# Altium schematic sheet M_Board1_2011.SchDoc
size A4
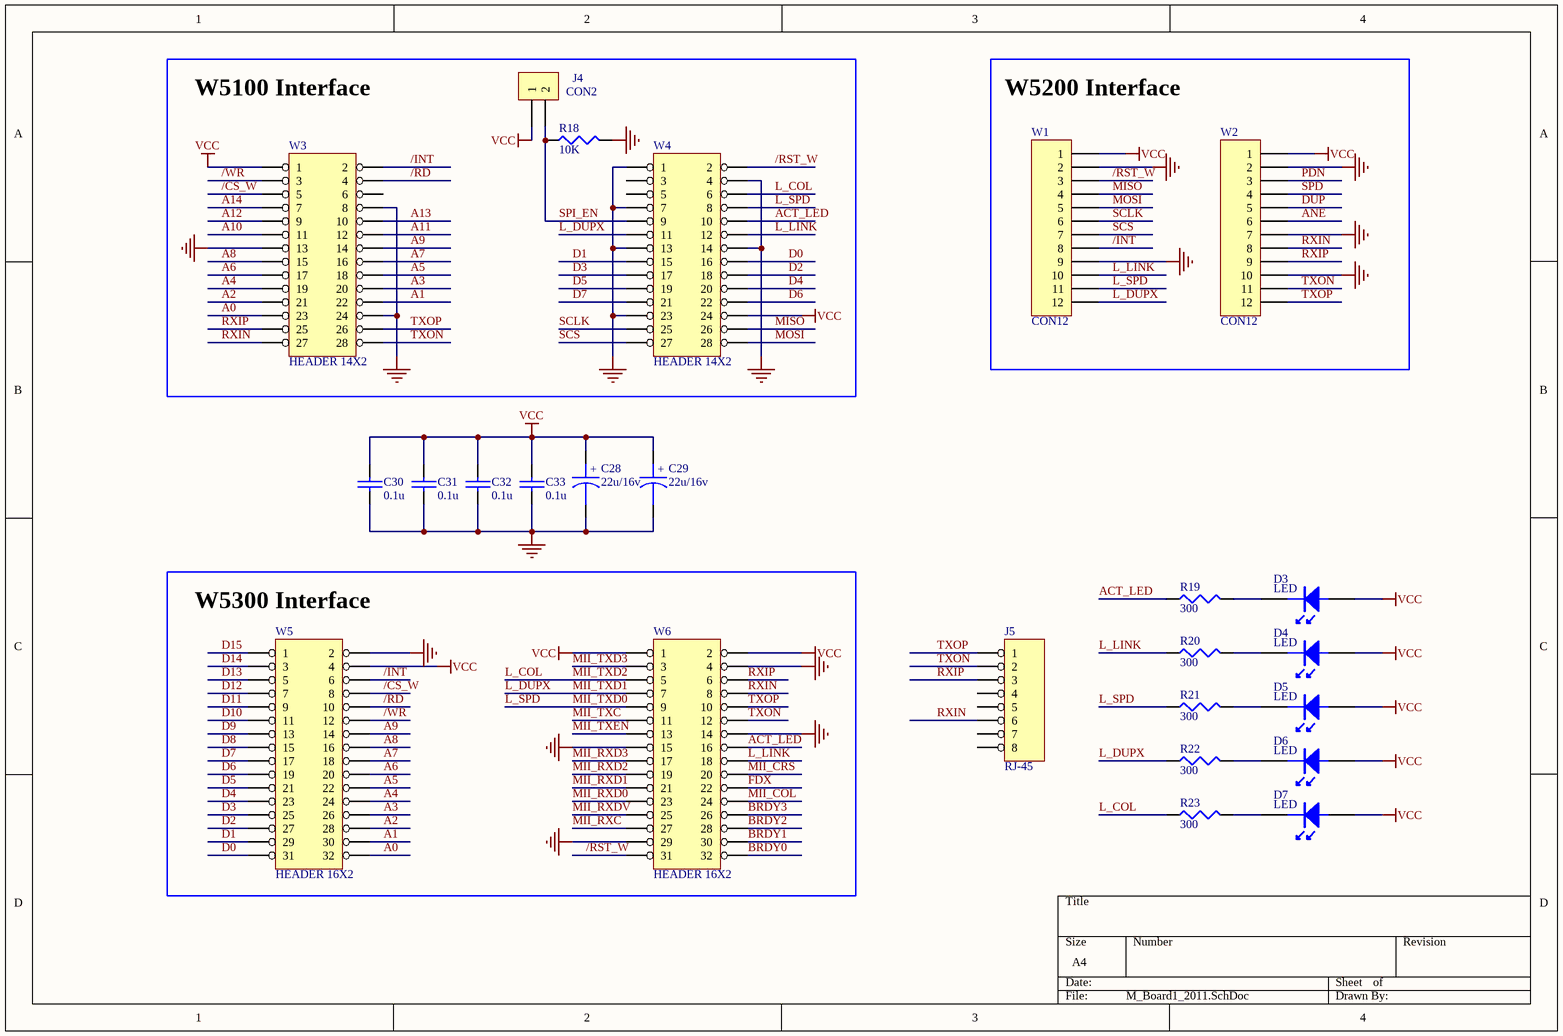
[diagram p0: M_Board1_2011.SchDoc]

## Parts
C28  22u/16v  [RB.1/.2N]
C29  22u/16v  [RB.1/.2N]
C30  0.1u  [0603]
C31  0.1u  [0603]
C32  0.1u  [0603]
C33  0.1u  [0603]
D3  LED  [LED2P]
D4  LED  [LED2P]
D5  LED  [LED2P]
D6  LED  [LED2P]
D7  LED  [LED2P]
J4  CON2  [SIP2]
J5  RJ-45  [RJ45-3]
R18  10K  [0603]
R19  300  [0603]
R20  300  [0603]
R21  300  [0603]
R22  300  [0603]
R23  300  [0603]
W1  CON12
W2  CON12
W3  HEADER 14X2  [IDC28-2]
W4  HEADER 14X2  [IDC28-2]
W5  HEADER 16X2  [IDC32-2]
W6  HEADER 16X2  [IDC32-2]

## Nets
GND: C28.2 C29.2 C30.1 C31.1 C32.1 C33.1 R18.2 W1.2 W1.9 W2.2 W2.7 W2.10 W3.8 W3.13 W3.24 W4.1 W4.4 W4.7 W4.13 W4.14 W4.23 W5.2 W6.4 W6.14 W6.15 W6.29
VCC: C28.1 C29.1 C30.2 C31.2 C32.2 C33.2 D3.A D4.A D5.A D6.A D7.A J4.1 W1.1 W2.1 W3.1 W4.24 W5.4 W6.1 W6.2
/CS_W: W3.5 W5.8
/INT: W1.8 W3.2 W5.6
/RD: W3.4 W5.10
/RST_W: W1.3 W4.2 W6.31
/WR: W3.3 W5.12
A0: W3.23 W5.32
A1: W3.22 W5.30
A2: W3.21 W5.28
A3: W3.20 W5.26
A4: W3.19 W5.24
A5: W3.18 W5.22
A6: W3.17 W5.20
A7: W3.16 W5.18
A8: W3.15 W5.16
A9: W3.14 W5.14
A10: W3.11
A11: W3.12
A12: W3.9
A13: W3.10
A14: W3.7
ACT_LED: R19.1 W4.10 W6.16
ANE: W2.6
BRDY0: W6.32
BRDY1: W6.30
BRDY2: W6.28
BRDY3: W6.26
D0: W4.16 W5.31
D1: W4.15 W5.29
D2: W4.18 W5.27
D3: W4.17 W5.25
D4: W4.20 W5.23
D5: W4.19 W5.21
D6: W4.22 W5.19
D7: W4.21 W5.17
D8: W5.15
D9: W5.13
D10: W5.11
D11: W5.9
D12: W5.7
D13: W5.5
D14: W5.3
D15: W5.1
DUP: W2.5
FDX: W6.22
L_COL: R23.1 W4.6 W6.5  [also labelled MII_TXD2]
L_DUPX: R22.1 W1.12 W4.11 W6.7  [also labelled MII_TXD1]
L_LINK: R20.1 W1.10 W4.12 W6.18
L_SPD: R21.1 W1.11 W4.8 W6.9  [also labelled MII_TXD0]
MII_COL: W6.24
MII_CRS: W6.20
MII_RXC: W6.27
MII_RXD0: W6.23
MII_RXD1: W6.21
MII_RXD2: W6.19
MII_RXD3: W6.17
MII_RXDV: W6.25
MII_TXC: W6.11
MII_TXD3: W6.3
MII_TXEN: W6.13
MISO: W1.4 W4.26
MOSI: W1.5 W4.28
PDN: W2.3
RXIN: J5.6 W2.8 W3.27 W6.8
RXIP: J5.3 W2.9 W3.25 W6.6
SCLK: W1.6 W4.25
SCS: W1.7 W4.27
SPD: W2.4
SPI_EN: J4.2 R18.1 W4.9
TXON: J5.2 W2.11 W3.28 W6.12
TXOP: J5.1 W2.12 W3.26 W6.10
NetD3_K: D3.K R19.2
NetD4_K: D4.K R20.2
NetD5_K: D5.K R21.2
NetD6_K: D6.K R22.2
NetD7_K: D7.K R23.2

Not connected (* = marked no-connect by the designer): J5 4 5 7 8; W3 6; W4 3 5

## Notes on the sheet
- W5100 Interface
- W5200 Interface
- (near W5) W5300 Interface
- (in symbol CAPACITOR POL) +

## Library data of the parts
C28 C29 = CAPACITOR POL: Capacitor
C30-C33 = CAP: Capacitor
J4 = CON2: Connector
J5 = 8 HEADER: 8 Pin Header
R18-R23 = RES1
W1 W2 = CON12: Connector